# EAGLE design ATtiny167 Study (EAGLE 7.2.0)
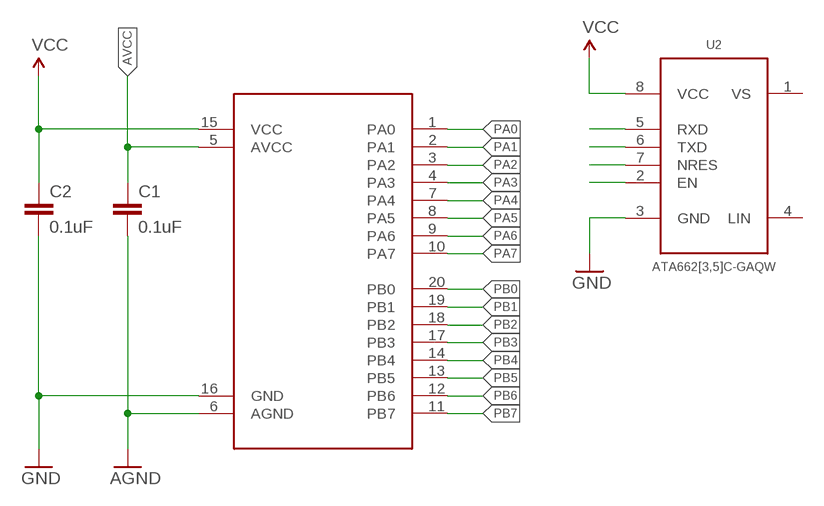
[diagram p0: schematic, sheet 1]

## Parts
C1  0.1uF  0.1UF-25V(+80/-20%)(0603)  [0603-CAP]
C2  0.1uF  0.1UF-25V(+80/-20%)(0603)  [0603-CAP]
U1  ATTINY87-SU  [20S2]
U2  ATA662[3,5]C-GAQW  [8S1]

## Nets
AGND: C1.2 U1.6(AGND)
AVCC: C1.1 U1.5(AVCC)
GND: C2.2 U1.16(GND) U2.3(GND)
N$9: U2.5(RXD)
N$10: U2.6(TXD)
N$11: U2.7(NRES)
N$12: U2.2(EN)
PA0: U1.1(PA0)
PA1: U1.2(PA1)
PA2: U1.3(PA2)
PA3: U1.4(PA3)
PA4: U1.7(PA4)
PA5: U1.8(PA5)
PA6: U1.9(PA6)
PA7: U1.10(PA7)
PB0: U1.20(PB0)
PB1: U1.19(PB1)
PB2: U1.18(PB2)
PB3: U1.17(PB3)
PB4: U1.14(PB4)
PB5: U1.13(PB5)
PB6: U1.12(PB6)
PB7: U1.11(PB7)
VCC: C2.1 U1.15(VCC) U2.8(VCC)
Unconnected: U2.4(LIN)

## Power pins joined to a net without a drawn wire
VS: U2.1(VS)

## Library data of the parts
C1 C2 = SparkFun-Capacitors:0.1UF-25V(+80/-20%)(0603): CAP-00810 Ceramic Standard decoupling cap; PROD_ID: CAP-00810
U1 = ATtiny[8,16]7:ATTINY87
U2 = ATtiny[8,16]7:ATA662[3,5]C

## Board
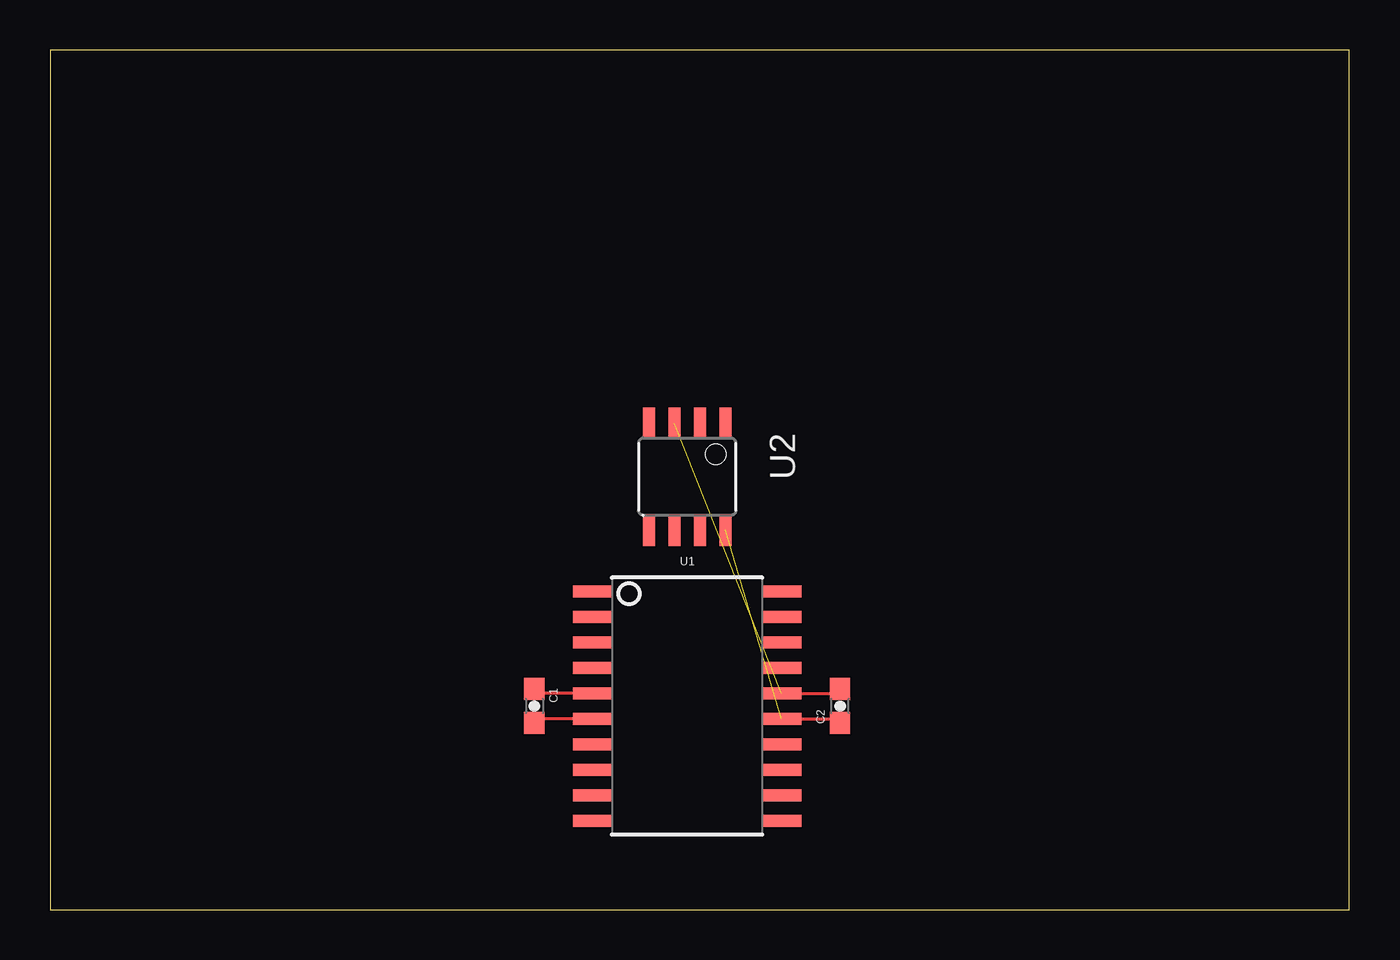
[diagram p1: board, top side]

Size 64.75 x 42.85 mm. Coordinates in mm from the lower left corner, seen from the top.
Outline: 0,0 64.75,0 64.75,42.85 0,42.85 0,0
Copper layers (1*16): Top 0.0356mm / dielectric 1.5011mm / Bottom 0.0356mm
Design rules "oshpark-2layer": minimum track width 6mil, minimum drill 13mil, track to track 6mil, track to pad 6mil, pad to pad 6mil, via to via 6mil, smd to smd 6mil, copper to edge 15mil, drill to drill 6mil, minimum pad ring 7mil, minimum via ring 7mil, stop-mask expansion 4mil, vias tented up to drill 0mil, thermal gap 10mil

### Footprints (pad centres in the part's own frame; a part is rotated, then mirrored left to right if it is on the bottom)
0603-CAP = smd 1.1 x 1: 1 -0.85,0; 2 0.85,0
20S2 = smd 2 x 0.6: 1 -4.7,5.715; 2 -4.7,4.445; 3 -4.7,3.175; 4 -4.7,1.905; 5 -4.7,0.635; 6 -4.7,-0.635; 7 -4.7,-1.905; 8 -4.7,-3.175; 9 -4.7,-4.445; 10 -4.7,-5.715; 11 4.7,-5.715; 12 4.7,-4.445; 13 4.7,-3.175; 14 4.7,-1.905; 15 4.7,-0.635; 16 4.7,0.635; 17 4.7,1.905; 18 4.7,3.175; 19 4.7,4.445; 20 4.7,5.715
8S1 = smd 0.6 x 1.6: 1 -1.905,-2.654; 2 -0.645,-2.654; 3 0.625,-2.654; 4 1.895,-2.654; 5 1.905,2.654; 6 0.635,2.654; 7 -0.635,2.654; 8 -1.905,2.654

### Placement (x,y rotation side)
C1  24.13,10.16 270 top
C2  39.37,10.16 90 top
U1  31.75,10.16 0 top
U2  31.75,21.59 180 top

### Tracks (layer width: path | path; a pad name or v marks a point on that pad's centre or on a via)
AGND
  Top 0.152: U1.6 24.34,9.53 C1.2
AVCC
  Top 0.152: U1.5 24.34,10.79 C1.1
GND  (1 unrouted)
  Top 0.152: U1.16 39.16,10.79 C2.2
VCC  (1 unrouted)
  Top 0.152: U1.15 39.16,9.53 C2.1